# Altium schematic sheet 0055_LED CON.SchDoc
size 848 x 558 mm
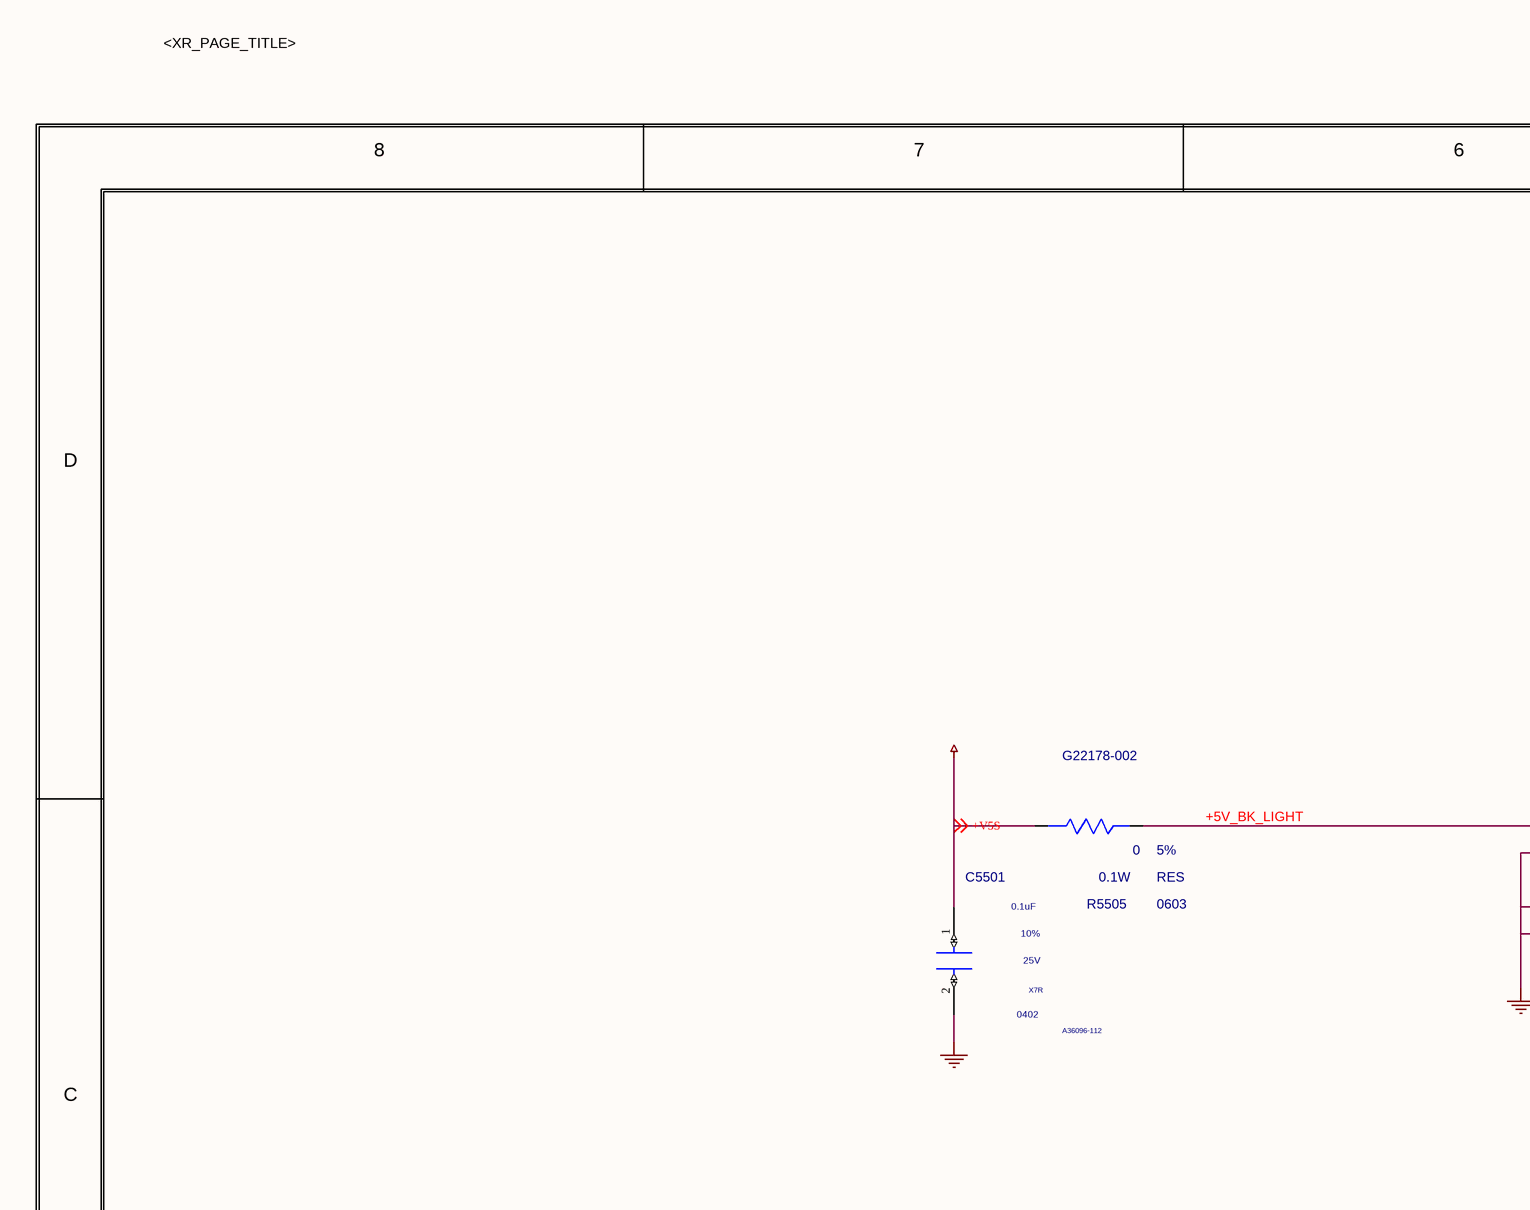
[diagram p0: 0055_LED CON.SchDoc, top left]
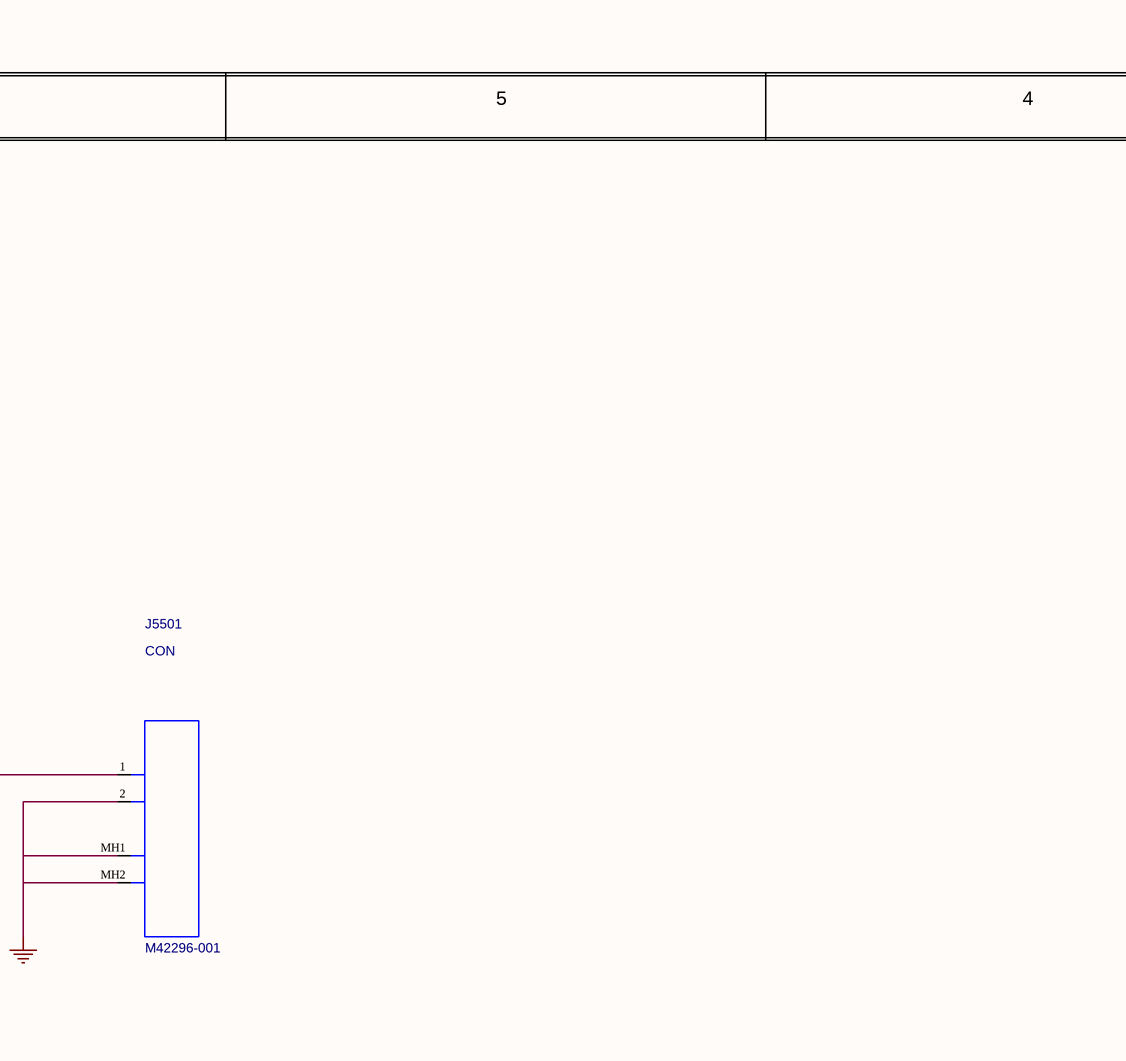
[diagram p1: 0055_LED CON.SchDoc, top middle]
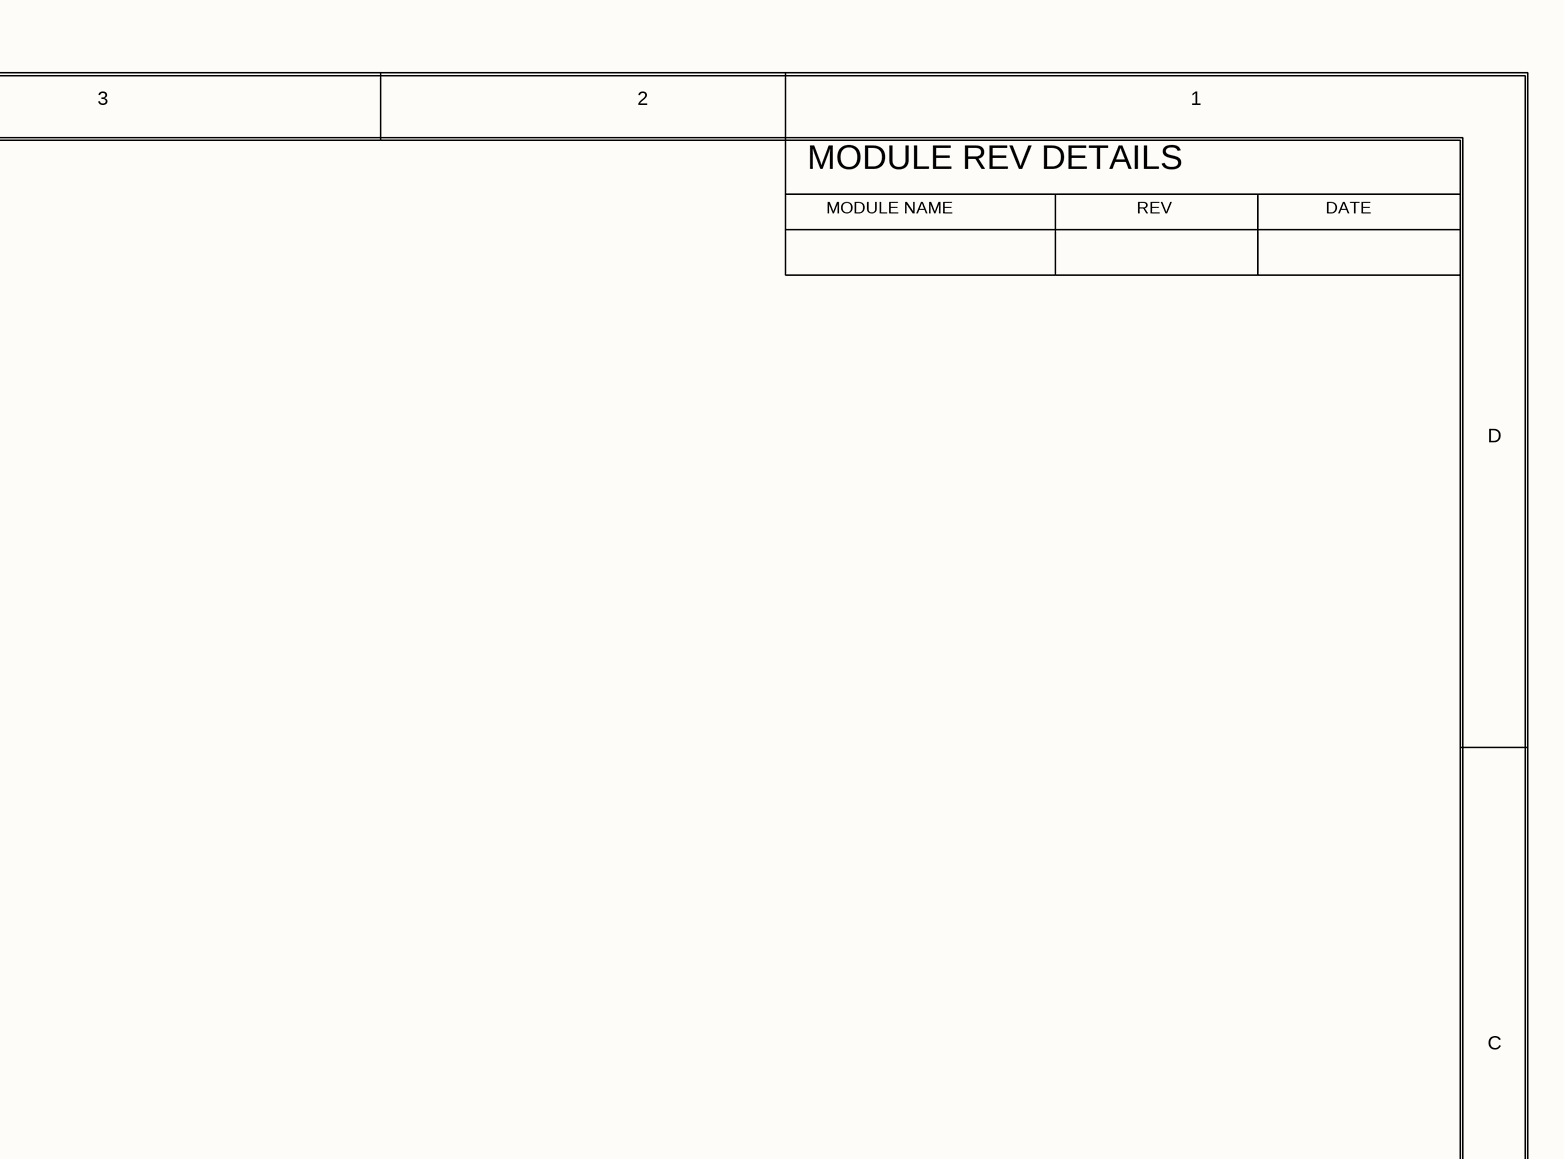
[diagram p2: 0055_LED CON.SchDoc, top right]
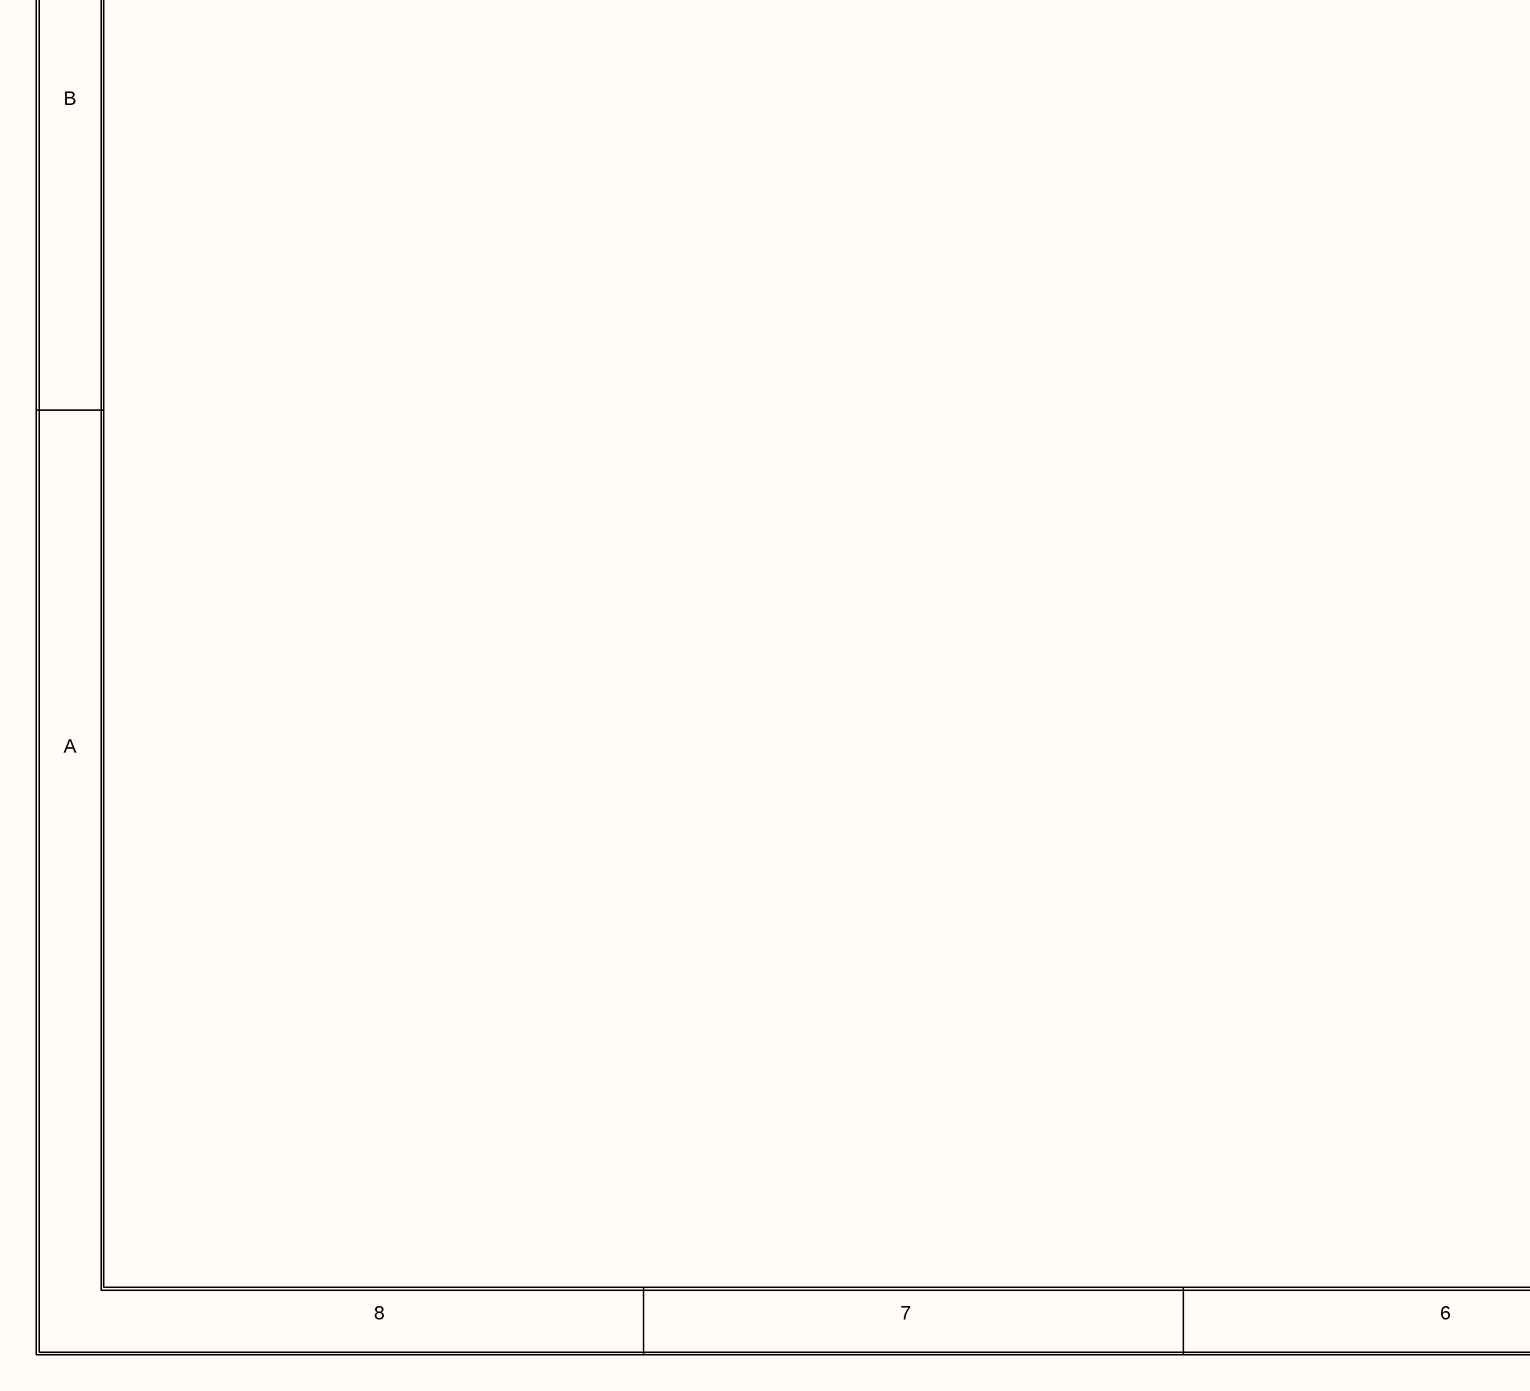
[diagram p3: 0055_LED CON.SchDoc, bottom left]
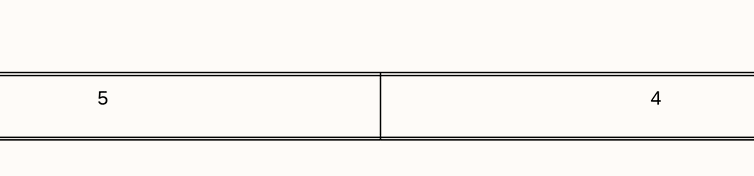
[diagram p4: 0055_LED CON.SchDoc, bottom middle]
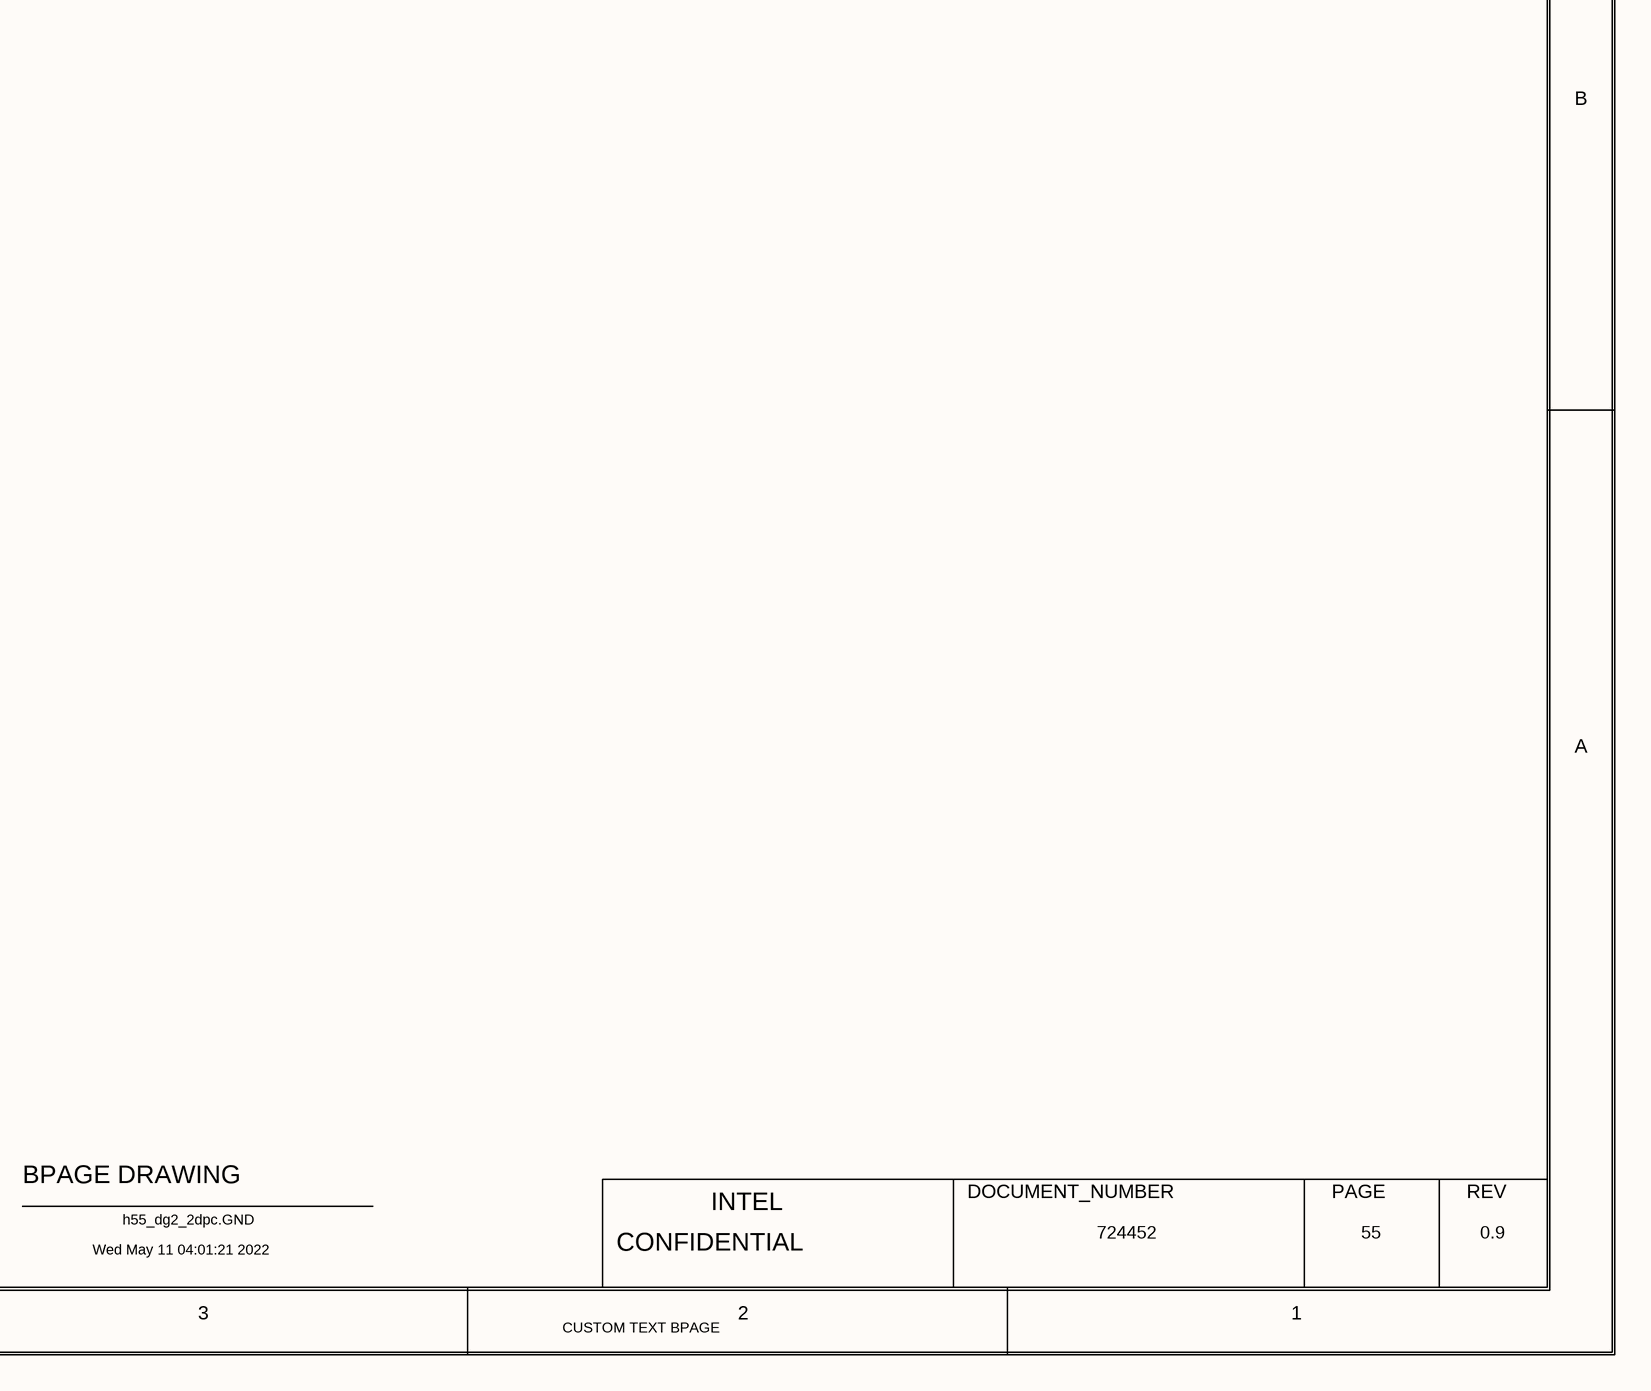
[diagram p5: 0055_LED CON.SchDoc, bottom right]

## Parts
C5501  0.1uF  MATERIAL: X7R  PACK_TYPE: 0402  PART_NUMBER: A36096-112  TOLERANCE: 10%  VOLTAGE: 25V  [SMC0402IA]
J5501  MATERIAL: CON  PART_NUMBER: M42296-001  [CTK0_B2B_SPR_1X2_2EM_1000_MA_VR]  (hidden comment: C_B2B_1X2_2EM)
R5505  0  MATERIAL: RES  PACK_TYPE: 0603  PART_NUMBER: G22178-002  TOLERANCE: 5%  WATTAGE: 0.1W  [CTK0_SM0603_1700X950_MA]

## Nets
+V5S: C5501.1(A) R5505.1(A) ; off-sheet +V5S
GND: C5501.2(B) J5501.2(IO2) J5501.MH1 J5501.MH2
+5V_BK_LIGHT: J5501.1(IO1) R5505.2(B)

## Notes on the sheet
- <XR_PAGE_TITLE>
- 8
- 7
- 6
- 5
- 4
- 3
- 2
- 1
- MODULE REV DETAILS
- MODULE NAME
- REV
- DATE
- D
- C
- B
- A
- BPAGE DRAWING
- INTEL
- DOCUMENT_NUMBER
- PAGE
- Wed May 11 04:01:21 2022
- h55_dg2_2dpc.GND
- CONFIDENTIAL
- 724452
- 55
- 0.9
- CUSTOM TEXT BPAGE

## Library data of the parts
C5501 = CAP: CDS_PHYS_PART_NAME: CAP_0402-A36096-112,X7R,0.1UF,25V,10%,LPDB,GENERIC; OriginalSymbolOrigin: (-50,25); XY: (-6850,3950); VER: 1; ROT: 2; PHYS_PAGE: 55; LOCATION: C5501; IP: GENERIC; FP_TECH: LPDB; DRAWING: @RVP1_ADL_SB_ADP_S_DDR5_SODIMM_2DPC_LIB.H55_DG2_2DPC(SCH_1):PAGE55; CDS_LIB: discrete; PCB Footprint: SMC0402IA; CHIPS_PART_NAME: CAP; CDS_PART_NAME: CAP_0402-A36096-112,X7R,0.1UF,25V,10%,LPDB,GENERIC; CDS_LOCATION: C5501; ASI_MODEL: A36096-112
J5501 = C_B2B_1X2_2EM: CDS_PHYS_PART_NAME: C_B2B_1X2_2EM_SM-M42296-001,CON,B2B_1X2_2EM,TK0,GENERIC; CDS_LMAN_SYM_OUTLINE: -50,200,50,-200; FP_TECH: TK0; IP: GENERIC; PACK_TYPE: SM; ROOM: NONE; OriginalSymbolOrigin: (-75,200); XY: (-5525,4100); VER: 1; ROT: 0; PHYS_PAGE: 55; LOCATION: J5501; DRAWING: @RVP1_ADL_SB_ADP_S_DDR5_SODIMM_2DPC_LIB.H55_DG2_2DPC(SCH_1):PAGE55; CDS_LIB: local; VARIANT: ?; PCB Footprint: CTK0_B2B_SPR_1X2_2EM_1000_MA_VR; SEC_TYPE: SM; CHIPS_PART_NAME: C_B2B_1X2_2EM; CDS_PART_NAME: C_B2B_1X2_2EM_SM-M42296-001,CON,B2B_1X2_2EM,TK0,GENERIC; CDS_LOCATION: J5501
R5505 = C_RES#1: CHIPS_PART_NAME: C_RES; CDS_PHYS_PART_NAME: C_RES_0603-G22178-002,RES,0,5%,0.1W,TK0,GENERIC; CDS_LMAN_SYM_OUTLINE: -50,50,50,-50; FP_TECH: TK0; IP: GENERIC; ROOM: NONE; OriginalSymbolOrigin: (-75,25); XY: (-6600,4200); VER: 1; PHYS_PAGE: 55; LOCATION: R5505; DRAWING: @RVP1_ADL_SB_ADP_S_DDR5_SODIMM_2DPC_LIB.H55_DG2_2DPC(SCH_1):PAGE55; CDS_LIB: c_discrete; VARIANT: ?; PCB Footprint: CTK0_SM0603_1700X950_MA; ROT: 0; CDS_PART_NAME: C_RES_0603-G22178-002,RES,0,5%,0.1W,TK0,GENERIC; CDS_LOCATION: R5505